# EAGLE design RTC_DS1307 (EAGLE 7.5.0)
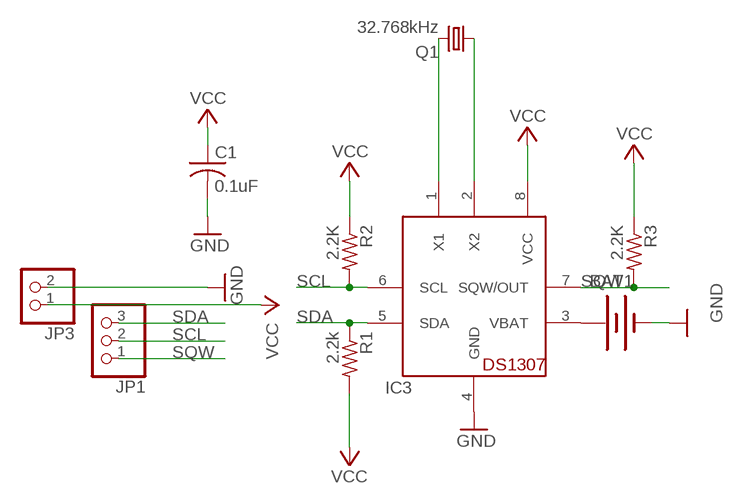
[diagram p0: schematic, sheet 1]

## Parts
BAT1  BATTERY20PTH  [BATTCOM_20MM_PTH]
C1  0.1uF  C-US025-025X050  [C025-025X050]
IC3  DS1307  [DIL08]
JP1  PINHD-1X3  [1X03]
JP3  PINHD-1X2  [1X02]
Q1  32.768kHz  CRYSTALTC26H  [TC26H]
R1  2.2k  R-US_0207/10  [0207/10]
R2  2.2K  R-US_0207/10  [0207/10]
R3  2.2K  R-US_0207/10  [0207/10]

## Nets
GND: BAT1.2(-) C1.2 IC3.4(GND) JP3.2
N$1: BAT1.1(+) IC3.3(VBAT)
N$14: IC3.1(X1) Q1.2
N$15: IC3.2(X2) Q1.1
SCL: IC3.6(SCL) JP1.2 R2.2
SDA: IC3.5(SDA) JP1.3 R1.1
SQW: IC3.7(SQW/OUT) JP1.1 R3.2
VCC: C1.1 IC3.8(VCC) JP3.1 R1.2 R2.1 R3.1

## Library data of the parts
BAT1 = SparkFun-Electromechanical:BATTERY: Battery Holders Various common sizes : AA, AAA, 18650 (PRT-12895), 20mm coin cell and 12mm coin cell. 20MM_4LEGS, BATT-10373
C1 = adafruit:C-US: CAPACITOR, American symbol
IC3 = adafruit:DS1307: DS1307 Real time clock (RTC) with battery backup ability. Talk to it via i2c
JP1 = pinhead:PINHD-1X3: PIN HEADER
JP3 = pinhead:PINHD-1X2: PIN HEADER
Q1 = SparkFun-FreqCtrl:CRYSTAL: Various standard crystals. Proven footprints.; PROD_ID: XTAL-10112
R1-R3 = adafruit:R-US_: RESISTOR, American symbol

## Board
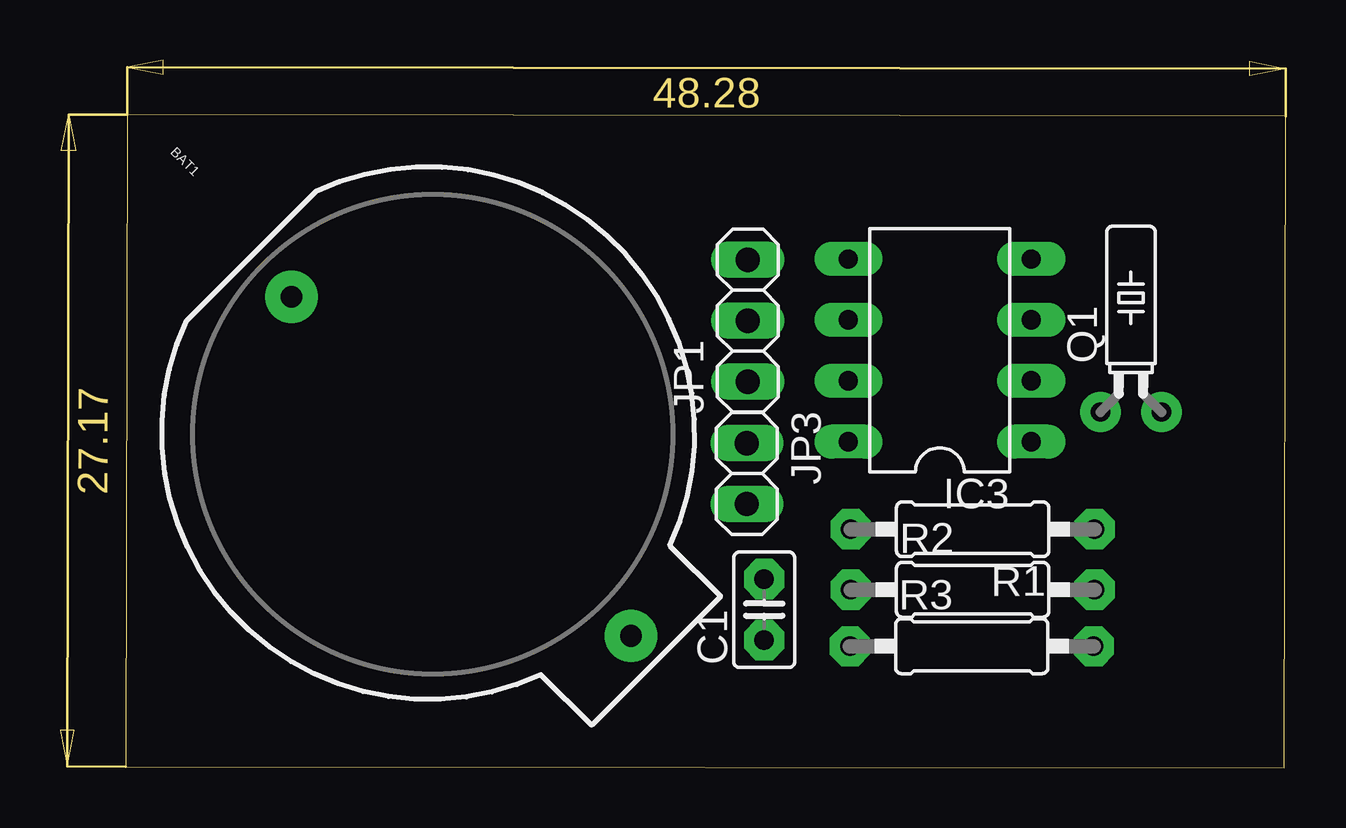
[diagram p1: board, top side]
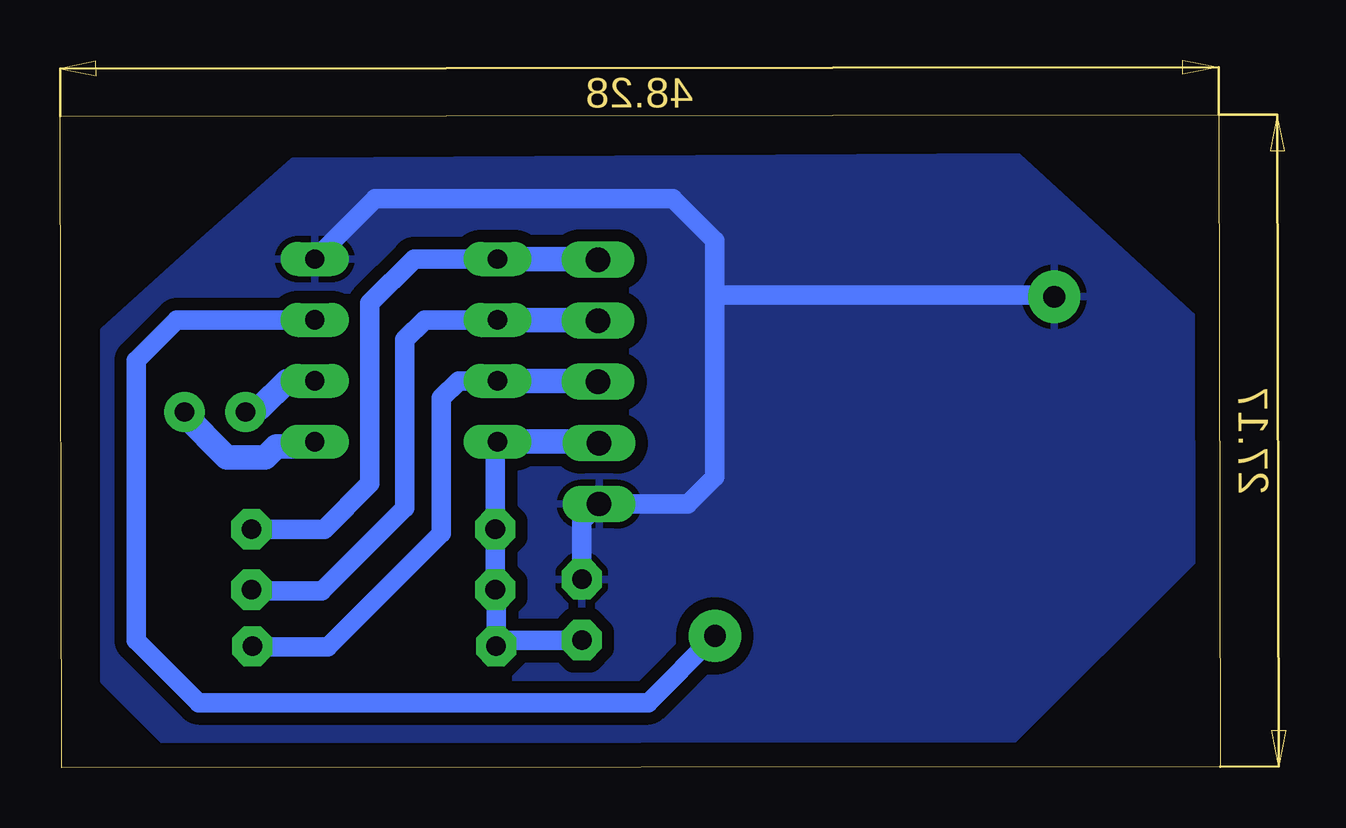
[diagram p2: board, bottom side, seen from below]

Size 48.34 x 27.23 mm. Coordinates in mm from the lower left corner, seen from the top.
Outline: 0,0.06 48.28,0 48.34,27.17 0.07,27.23 0,0.06
Copper layers (1*16): Top 0.035mm / dielectric 1.5mm / Bottom 0.035mm
Design rules "default *": minimum track width 40mil, minimum drill 24mil, track to track 20mil, track to pad 20mil, pad to pad 8mil, via to via 8mil, smd to smd 8mil, copper to edge 40mil, drill to drill 8mil, minimum pad ring 10mil, minimum via ring 8mil, stop-mask expansion 4mil, vias tented up to drill 0mil, thermal gap 10mil

### Footprints (pad centres in the part's own frame; a part is rotated, then mirrored left to right if it is on the bottom)
BATTCOM_20MM_PTH = drill 0.9 pad 2.184: 1 11.85,0; 2 -8.15,0
C025-025X050 = drill 0.813 pad 1.676 octagon: 1 -1.27,0; 2 1.27,0
DIL08 = drill 0.8 pad 1.422 long: 1 -3.81,-3.81; 2 -1.27,-3.81; 3 1.27,-3.81; 4 3.81,-3.81; 5 3.81,3.81; 6 1.27,3.81; 7 -1.27,3.81; 8 -3.81,3.81
1X03 = drill 1.016 long: 1 -2.54,0; 2 0,0; 3 2.54,0
1X02 = drill 1.016 long: 1 -1.27,0; 2 1.27,0
TC26H = drill 0.8 pad 1.676: 1 -1.27,0; 2 1.27,0
0207/10 = drill 0.813 pad 1.676 octagon: 1 -5.08,0; 2 5.08,0

### Placement (x,y rotation side)
BAT1  12.68,13.89 315 top
C1  26.6,6.6 90 top
IC3  33.92,17.41 90 top
JP1  25.92,18.65 90 top
JP3  25.88,12.28 270 top
Q1  41.89,14.84 0 top
R1  35.29,9.96 180 top
R2  35.29,7.43 0 top
R3  35.25,5.08 0 top

### Tracks (layer width: path | path; a pad name or v marks a point on that pad's centre or on a via)
GND
  Bottom 0.813: C1.2 26.6,10.28 JP3.2 22.19,11.01 21.06,12.13 21.06,19.72 | IC3.4 35.21,23.75 22.81,23.75 21.06,22 21.06,19.72 | BAT1.2 6.99,19.72 21.06,19.72
  pour Bottom: 38.62,25.3 8.45,25.5 1.11,18.75 1.11,8.68 8.95,0.84 43.73,0.84 46.52,3.63 46.52,18.24 42.37,21.99
N$1
  Bottom 0.813: IC3.3 43.47,18.68 45.16,17 45.16,5.31 42.57,2.72 23.84,2.72 BAT1.1
N$14
  Bottom 1.016: IC3.1 37.73,13.4 39.33,13.4 39.79,12.94 41.39,12.94 43.22,14.77 Q1.2
N$15
  Bottom 1.016: IC3.2 38.88,16.14 40.02,15 40.48,15 Q1.1
SCL
  Bottom 0.813: IC3.6 33.15,18.68 33.98,17.86 33.98,10.85 37.44,7.39 40.33,7.39 R2.2
  Bottom 1.016: IC3.6 25.92,18.68 JP1.2
SDA
  Bottom 0.813: IC3.5 33.59,21.22 35.43,19.38 35.43,11.86 37.34,9.96 R1.1
  Bottom 1.016: IC3.5 25.92,21.22 JP1.3
SQW
  Bottom 0.813: IC3.7 31.74,16.14 32.45,15.43 32.45,9.78 37.18,5.05 40.31,5.05 R3.2
  Bottom 1.016: IC3.7 25.92,16.14 JP1.1
VCC
  Bottom 0.813: IC3.8 30.21,13.51 R1.2 R2.1 30.17,7.4 R3.1 29.92,5.33 C1.1
  Bottom 1.016: IC3.8 25.88,13.6 JP3.1